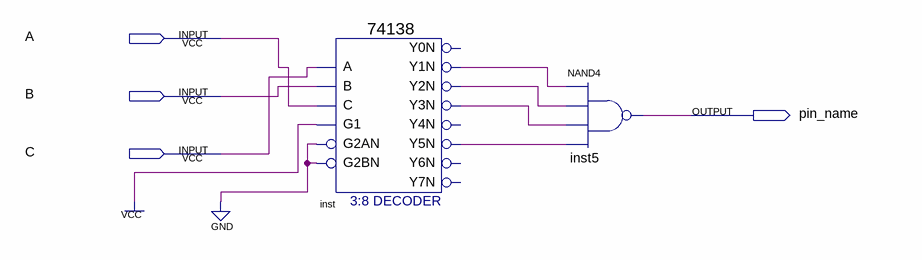
[diagram p0: schematic sheet]
// Quartus schematic Block1.bdf as structural Verilog: 2 symbols, 4 pins
module Block1 (
  input  A,
  input  B,
  input  C,
  output pin_name
);

  wire inst_y1n, inst_y2n, inst_y3n, inst_y5n;

  \74138  inst (
    .A(C), .B(B), .G1(1'b1), .C(A), .G2AN(1'b0), .G2BN(1'b0), .Y1N(inst_y1n), .Y2N(inst_y2n), .Y3N(inst_y3n),
    .Y5N(inst_y5n));  // open: Y0N, Y4N, Y6N, Y7N
  nand inst5 (pin_name, inst_y1n, inst_y2n, inst_y3n, inst_y5n);
endmodule
